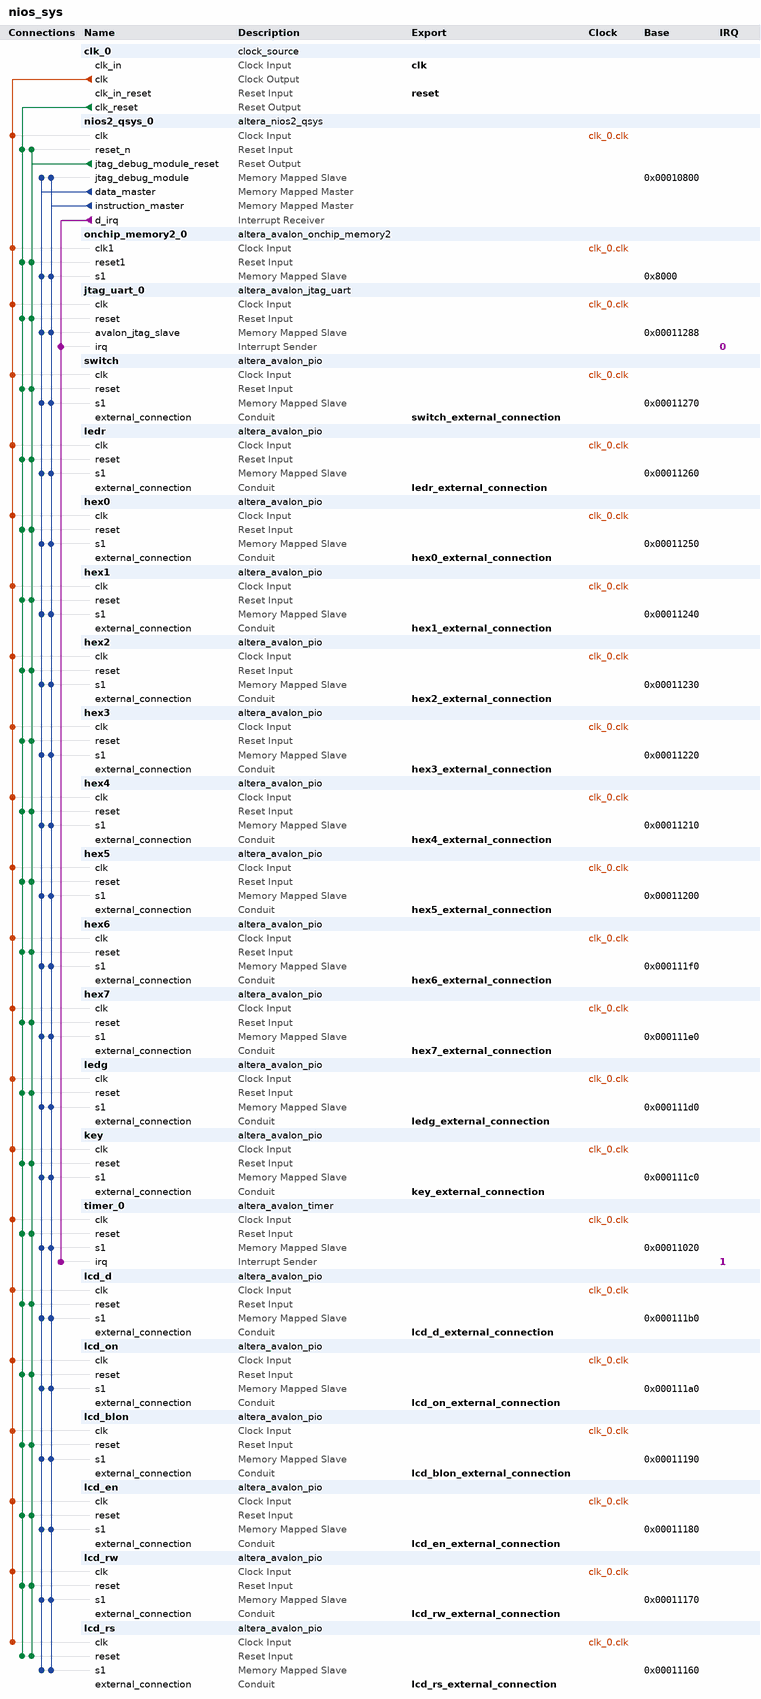
[diagram p0: system contents]
# Platform Designer (Qsys) system nios_sys, Cyclone II EP2C35F672C6
# Parameters at their usual value, and those the tool derives, are not listed.
package require -exact qsys 13.0.1.99.2
create_system nios_sys
set_project_property DEVICE_FAMILY {Cyclone II}
set_project_property DEVICE EP2C35F672C6

add_instance clk_0 clock_source 13.0
set_instance_parameter_value clk_0 clockFrequency 50000000

add_instance nios2_qsys_0 altera_nios2_qsys 13.0
set_instance_parameter_value nios2_qsys_0 resetSlave onchip_memory2_0.s1
set_instance_parameter_value nios2_qsys_0 mmu_TLBMissExcSlave None
set_instance_parameter_value nios2_qsys_0 exceptionSlave onchip_memory2_0.s1
set_instance_parameter_value nios2_qsys_0 breakSlave nios2_qsys_0.jtag_debug_module
set_instance_parameter_value nios2_qsys_0 impl Tiny
set_instance_parameter_value nios2_qsys_0 icache_size 4096

add_instance onchip_memory2_0 altera_avalon_onchip_memory2 13.0.1.99.2
set_instance_parameter_value onchip_memory2_0 dataWidth 32
set_instance_parameter_value onchip_memory2_0 dualPort false
set_instance_parameter_value onchip_memory2_0 initMemContent true
set_instance_parameter_value onchip_memory2_0 initializationFileName onchip_mem.hex
set_instance_parameter_value onchip_memory2_0 memorySize 32768

add_instance jtag_uart_0 altera_avalon_jtag_uart 13.0.1.99.2
set_instance_parameter_value jtag_uart_0 simInteractiveOptions NO_INTERACTIVE_WINDOWS

add_instance switch altera_avalon_pio 13.0.1.99.2
set_instance_parameter_value switch direction Input
set_instance_parameter_value switch width 18

add_instance ledr altera_avalon_pio 13.0.1.99.2
set_instance_parameter_value ledr direction Output
set_instance_parameter_value ledr width 18

add_instance hex0 altera_avalon_pio 13.0.1.99.2
set_instance_parameter_value hex0 direction Output
set_instance_parameter_value hex0 width 7

add_instance hex1 altera_avalon_pio 13.0.1.99.2
set_instance_parameter_value hex1 direction Output
set_instance_parameter_value hex1 width 7

add_instance hex2 altera_avalon_pio 13.0.1.99.2
set_instance_parameter_value hex2 direction Output
set_instance_parameter_value hex2 width 7

add_instance hex3 altera_avalon_pio 13.0.1.99.2
set_instance_parameter_value hex3 direction Output
set_instance_parameter_value hex3 width 7

add_instance hex4 altera_avalon_pio 13.0.1.99.2
set_instance_parameter_value hex4 direction Output
set_instance_parameter_value hex4 width 7

add_instance hex5 altera_avalon_pio 13.0.1.99.2
set_instance_parameter_value hex5 direction Output
set_instance_parameter_value hex5 width 7

add_instance hex6 altera_avalon_pio 13.0.1.99.2
set_instance_parameter_value hex6 direction Output
set_instance_parameter_value hex6 width 7

add_instance hex7 altera_avalon_pio 13.0.1.99.2
set_instance_parameter_value hex7 direction Output
set_instance_parameter_value hex7 width 7

add_instance ledg altera_avalon_pio 13.0.1.99.2
set_instance_parameter_value ledg direction Output
set_instance_parameter_value ledg width 4

add_instance key altera_avalon_pio 13.0.1.99.2
set_instance_parameter_value key direction Input
set_instance_parameter_value key width 4

add_instance timer_0 altera_avalon_timer 13.0.1.99.2
set_instance_parameter_value timer_0 period 1
set_instance_parameter_value timer_0 periodUnits MSEC

add_instance lcd_d altera_avalon_pio 13.0.1.99.2
set_instance_parameter_value lcd_d direction Output
set_instance_parameter_value lcd_d width 8

add_instance lcd_on altera_avalon_pio 13.0.1.99.2
set_instance_parameter_value lcd_on direction Output
set_instance_parameter_value lcd_on width 1

add_instance lcd_blon altera_avalon_pio 13.0.1.99.2
set_instance_parameter_value lcd_blon direction Output
set_instance_parameter_value lcd_blon width 1

add_instance lcd_en altera_avalon_pio 13.0.1.99.2
set_instance_parameter_value lcd_en direction Output
set_instance_parameter_value lcd_en width 1

add_instance lcd_rw altera_avalon_pio 13.0.1.99.2
set_instance_parameter_value lcd_rw direction Output
set_instance_parameter_value lcd_rw width 1

add_instance lcd_rs altera_avalon_pio 13.0.1.99.2
set_instance_parameter_value lcd_rs direction Output
set_instance_parameter_value lcd_rs width 1

# connections
add_connection clk_0.clk hex0.clk clock
add_connection clk_0.clk hex1.clk clock
add_connection clk_0.clk hex2.clk clock
add_connection clk_0.clk hex3.clk clock
add_connection clk_0.clk hex4.clk clock
add_connection clk_0.clk hex5.clk clock
add_connection clk_0.clk hex6.clk clock
add_connection clk_0.clk hex7.clk clock
add_connection clk_0.clk jtag_uart_0.clk clock
add_connection clk_0.clk key.clk clock
add_connection clk_0.clk lcd_blon.clk clock
add_connection clk_0.clk lcd_d.clk clock
add_connection clk_0.clk lcd_en.clk clock
add_connection clk_0.clk lcd_on.clk clock
add_connection clk_0.clk lcd_rs.clk clock
add_connection clk_0.clk lcd_rw.clk clock
add_connection clk_0.clk ledg.clk clock
add_connection clk_0.clk ledr.clk clock
add_connection clk_0.clk nios2_qsys_0.clk clock
add_connection clk_0.clk onchip_memory2_0.clk1 clock
add_connection clk_0.clk switch.clk clock
add_connection clk_0.clk timer_0.clk clock
add_connection clk_0.clk_reset hex0.reset reset
add_connection clk_0.clk_reset hex1.reset reset
add_connection clk_0.clk_reset hex2.reset reset
add_connection clk_0.clk_reset hex3.reset reset
add_connection clk_0.clk_reset hex4.reset reset
add_connection clk_0.clk_reset hex5.reset reset
add_connection clk_0.clk_reset hex6.reset reset
add_connection clk_0.clk_reset hex7.reset reset
add_connection clk_0.clk_reset jtag_uart_0.reset reset
add_connection clk_0.clk_reset key.reset reset
add_connection clk_0.clk_reset lcd_blon.reset reset
add_connection clk_0.clk_reset lcd_d.reset reset
add_connection clk_0.clk_reset lcd_en.reset reset
add_connection clk_0.clk_reset lcd_on.reset reset
add_connection clk_0.clk_reset lcd_rs.reset reset
add_connection clk_0.clk_reset lcd_rw.reset reset
add_connection clk_0.clk_reset ledg.reset reset
add_connection clk_0.clk_reset ledr.reset reset
add_connection clk_0.clk_reset nios2_qsys_0.reset_n reset
add_connection clk_0.clk_reset onchip_memory2_0.reset1 reset
add_connection clk_0.clk_reset switch.reset reset
add_connection clk_0.clk_reset timer_0.reset reset
add_connection nios2_qsys_0.jtag_debug_module_reset hex0.reset reset
add_connection nios2_qsys_0.jtag_debug_module_reset hex1.reset reset
add_connection nios2_qsys_0.jtag_debug_module_reset hex2.reset reset
add_connection nios2_qsys_0.jtag_debug_module_reset hex3.reset reset
add_connection nios2_qsys_0.jtag_debug_module_reset hex4.reset reset
add_connection nios2_qsys_0.jtag_debug_module_reset hex5.reset reset
add_connection nios2_qsys_0.jtag_debug_module_reset hex6.reset reset
add_connection nios2_qsys_0.jtag_debug_module_reset hex7.reset reset
add_connection nios2_qsys_0.jtag_debug_module_reset jtag_uart_0.reset reset
add_connection nios2_qsys_0.jtag_debug_module_reset key.reset reset
add_connection nios2_qsys_0.jtag_debug_module_reset lcd_blon.reset reset
add_connection nios2_qsys_0.jtag_debug_module_reset lcd_d.reset reset
add_connection nios2_qsys_0.jtag_debug_module_reset lcd_en.reset reset
add_connection nios2_qsys_0.jtag_debug_module_reset lcd_on.reset reset
add_connection nios2_qsys_0.jtag_debug_module_reset lcd_rs.reset reset
add_connection nios2_qsys_0.jtag_debug_module_reset lcd_rw.reset reset
add_connection nios2_qsys_0.jtag_debug_module_reset ledg.reset reset
add_connection nios2_qsys_0.jtag_debug_module_reset ledr.reset reset
add_connection nios2_qsys_0.jtag_debug_module_reset nios2_qsys_0.reset_n reset
add_connection nios2_qsys_0.jtag_debug_module_reset onchip_memory2_0.reset1 reset
add_connection nios2_qsys_0.jtag_debug_module_reset switch.reset reset
add_connection nios2_qsys_0.jtag_debug_module_reset timer_0.reset reset
add_connection nios2_qsys_0.data_master hex0.s1 avalon
set_connection_parameter_value nios2_qsys_0.data_master/hex0.s1 baseAddress 0x00011250
add_connection nios2_qsys_0.data_master hex1.s1 avalon
set_connection_parameter_value nios2_qsys_0.data_master/hex1.s1 baseAddress 0x00011240
add_connection nios2_qsys_0.data_master hex2.s1 avalon
set_connection_parameter_value nios2_qsys_0.data_master/hex2.s1 baseAddress 0x00011230
add_connection nios2_qsys_0.data_master hex3.s1 avalon
set_connection_parameter_value nios2_qsys_0.data_master/hex3.s1 baseAddress 0x00011220
add_connection nios2_qsys_0.data_master hex4.s1 avalon
set_connection_parameter_value nios2_qsys_0.data_master/hex4.s1 baseAddress 0x00011210
add_connection nios2_qsys_0.data_master hex5.s1 avalon
set_connection_parameter_value nios2_qsys_0.data_master/hex5.s1 baseAddress 0x00011200
add_connection nios2_qsys_0.data_master hex6.s1 avalon
set_connection_parameter_value nios2_qsys_0.data_master/hex6.s1 baseAddress 0x000111f0
add_connection nios2_qsys_0.data_master hex7.s1 avalon
set_connection_parameter_value nios2_qsys_0.data_master/hex7.s1 baseAddress 0x000111e0
add_connection nios2_qsys_0.data_master jtag_uart_0.avalon_jtag_slave avalon
set_connection_parameter_value nios2_qsys_0.data_master/jtag_uart_0.avalon_jtag_slave baseAddress 0x00011288
add_connection nios2_qsys_0.data_master key.s1 avalon
set_connection_parameter_value nios2_qsys_0.data_master/key.s1 baseAddress 0x000111c0
add_connection nios2_qsys_0.data_master lcd_blon.s1 avalon
set_connection_parameter_value nios2_qsys_0.data_master/lcd_blon.s1 baseAddress 0x00011190
add_connection nios2_qsys_0.data_master lcd_d.s1 avalon
set_connection_parameter_value nios2_qsys_0.data_master/lcd_d.s1 baseAddress 0x000111b0
add_connection nios2_qsys_0.data_master lcd_en.s1 avalon
set_connection_parameter_value nios2_qsys_0.data_master/lcd_en.s1 baseAddress 0x00011180
add_connection nios2_qsys_0.data_master lcd_on.s1 avalon
set_connection_parameter_value nios2_qsys_0.data_master/lcd_on.s1 baseAddress 0x000111a0
add_connection nios2_qsys_0.data_master lcd_rs.s1 avalon
set_connection_parameter_value nios2_qsys_0.data_master/lcd_rs.s1 baseAddress 0x00011160
add_connection nios2_qsys_0.data_master lcd_rw.s1 avalon
set_connection_parameter_value nios2_qsys_0.data_master/lcd_rw.s1 baseAddress 0x00011170
add_connection nios2_qsys_0.data_master ledg.s1 avalon
set_connection_parameter_value nios2_qsys_0.data_master/ledg.s1 baseAddress 0x000111d0
add_connection nios2_qsys_0.data_master ledr.s1 avalon
set_connection_parameter_value nios2_qsys_0.data_master/ledr.s1 baseAddress 0x00011260
add_connection nios2_qsys_0.data_master nios2_qsys_0.jtag_debug_module avalon
set_connection_parameter_value nios2_qsys_0.data_master/nios2_qsys_0.jtag_debug_module baseAddress 0x00010800
add_connection nios2_qsys_0.data_master onchip_memory2_0.s1 avalon
set_connection_parameter_value nios2_qsys_0.data_master/onchip_memory2_0.s1 baseAddress 0x8000
add_connection nios2_qsys_0.data_master switch.s1 avalon
set_connection_parameter_value nios2_qsys_0.data_master/switch.s1 baseAddress 0x00011270
add_connection nios2_qsys_0.data_master timer_0.s1 avalon
set_connection_parameter_value nios2_qsys_0.data_master/timer_0.s1 baseAddress 0x00011020
add_connection nios2_qsys_0.instruction_master hex0.s1 avalon
set_connection_parameter_value nios2_qsys_0.instruction_master/hex0.s1 baseAddress 0x00011250
add_connection nios2_qsys_0.instruction_master hex1.s1 avalon
set_connection_parameter_value nios2_qsys_0.instruction_master/hex1.s1 baseAddress 0x00011240
add_connection nios2_qsys_0.instruction_master hex2.s1 avalon
set_connection_parameter_value nios2_qsys_0.instruction_master/hex2.s1 baseAddress 0x00011230
add_connection nios2_qsys_0.instruction_master hex3.s1 avalon
set_connection_parameter_value nios2_qsys_0.instruction_master/hex3.s1 baseAddress 0x00011220
add_connection nios2_qsys_0.instruction_master hex4.s1 avalon
set_connection_parameter_value nios2_qsys_0.instruction_master/hex4.s1 baseAddress 0x00011210
add_connection nios2_qsys_0.instruction_master hex5.s1 avalon
set_connection_parameter_value nios2_qsys_0.instruction_master/hex5.s1 baseAddress 0x00011200
add_connection nios2_qsys_0.instruction_master hex6.s1 avalon
set_connection_parameter_value nios2_qsys_0.instruction_master/hex6.s1 baseAddress 0x000111f0
add_connection nios2_qsys_0.instruction_master hex7.s1 avalon
set_connection_parameter_value nios2_qsys_0.instruction_master/hex7.s1 baseAddress 0x000111e0
add_connection nios2_qsys_0.instruction_master jtag_uart_0.avalon_jtag_slave avalon
set_connection_parameter_value nios2_qsys_0.instruction_master/jtag_uart_0.avalon_jtag_slave baseAddress 0x00011288
add_connection nios2_qsys_0.instruction_master key.s1 avalon
set_connection_parameter_value nios2_qsys_0.instruction_master/key.s1 baseAddress 0x000111c0
add_connection nios2_qsys_0.instruction_master lcd_blon.s1 avalon
set_connection_parameter_value nios2_qsys_0.instruction_master/lcd_blon.s1 baseAddress 0x00011190
add_connection nios2_qsys_0.instruction_master lcd_d.s1 avalon
set_connection_parameter_value nios2_qsys_0.instruction_master/lcd_d.s1 baseAddress 0x000111b0
add_connection nios2_qsys_0.instruction_master lcd_en.s1 avalon
set_connection_parameter_value nios2_qsys_0.instruction_master/lcd_en.s1 baseAddress 0x00011180
add_connection nios2_qsys_0.instruction_master lcd_on.s1 avalon
set_connection_parameter_value nios2_qsys_0.instruction_master/lcd_on.s1 baseAddress 0x000111a0
add_connection nios2_qsys_0.instruction_master lcd_rs.s1 avalon
set_connection_parameter_value nios2_qsys_0.instruction_master/lcd_rs.s1 baseAddress 0x00011160
add_connection nios2_qsys_0.instruction_master lcd_rw.s1 avalon
set_connection_parameter_value nios2_qsys_0.instruction_master/lcd_rw.s1 baseAddress 0x00011170
add_connection nios2_qsys_0.instruction_master ledg.s1 avalon
set_connection_parameter_value nios2_qsys_0.instruction_master/ledg.s1 baseAddress 0x000111d0
add_connection nios2_qsys_0.instruction_master ledr.s1 avalon
set_connection_parameter_value nios2_qsys_0.instruction_master/ledr.s1 baseAddress 0x00011260
add_connection nios2_qsys_0.instruction_master nios2_qsys_0.jtag_debug_module avalon
set_connection_parameter_value nios2_qsys_0.instruction_master/nios2_qsys_0.jtag_debug_module baseAddress 0x00010800
add_connection nios2_qsys_0.instruction_master onchip_memory2_0.s1 avalon
set_connection_parameter_value nios2_qsys_0.instruction_master/onchip_memory2_0.s1 baseAddress 0x8000
add_connection nios2_qsys_0.instruction_master switch.s1 avalon
set_connection_parameter_value nios2_qsys_0.instruction_master/switch.s1 baseAddress 0x00011270
add_connection nios2_qsys_0.instruction_master timer_0.s1 avalon
set_connection_parameter_value nios2_qsys_0.instruction_master/timer_0.s1 baseAddress 0x00011020
add_connection nios2_qsys_0.d_irq jtag_uart_0.irq interrupt
set_connection_parameter_value nios2_qsys_0.d_irq/jtag_uart_0.irq irqNumber 0
add_connection nios2_qsys_0.d_irq timer_0.irq interrupt
set_connection_parameter_value nios2_qsys_0.d_irq/timer_0.irq irqNumber 1

# exported interfaces
add_interface clk clock sink
set_interface_property clk EXPORT_OF clk_0.clk_in
add_interface reset reset sink
set_interface_property reset EXPORT_OF clk_0.clk_in_reset
add_interface hex7_external_connection conduit end
set_interface_property hex7_external_connection EXPORT_OF hex7.external_connection
add_interface hex6_external_connection conduit end
set_interface_property hex6_external_connection EXPORT_OF hex6.external_connection
add_interface hex5_external_connection conduit end
set_interface_property hex5_external_connection EXPORT_OF hex5.external_connection
add_interface hex4_external_connection conduit end
set_interface_property hex4_external_connection EXPORT_OF hex4.external_connection
add_interface hex3_external_connection conduit end
set_interface_property hex3_external_connection EXPORT_OF hex3.external_connection
add_interface hex2_external_connection conduit end
set_interface_property hex2_external_connection EXPORT_OF hex2.external_connection
add_interface hex1_external_connection conduit end
set_interface_property hex1_external_connection EXPORT_OF hex1.external_connection
add_interface hex0_external_connection conduit end
set_interface_property hex0_external_connection EXPORT_OF hex0.external_connection
add_interface ledr_external_connection conduit end
set_interface_property ledr_external_connection EXPORT_OF ledr.external_connection
add_interface switch_external_connection conduit end
set_interface_property switch_external_connection EXPORT_OF switch.external_connection
add_interface ledg_external_connection conduit end
set_interface_property ledg_external_connection EXPORT_OF ledg.external_connection
add_interface key_external_connection conduit end
set_interface_property key_external_connection EXPORT_OF key.external_connection
add_interface lcd_rs_external_connection conduit end
set_interface_property lcd_rs_external_connection EXPORT_OF lcd_rs.external_connection
add_interface lcd_rw_external_connection conduit end
set_interface_property lcd_rw_external_connection EXPORT_OF lcd_rw.external_connection
add_interface lcd_en_external_connection conduit end
set_interface_property lcd_en_external_connection EXPORT_OF lcd_en.external_connection
add_interface lcd_blon_external_connection conduit end
set_interface_property lcd_blon_external_connection EXPORT_OF lcd_blon.external_connection
add_interface lcd_on_external_connection conduit end
set_interface_property lcd_on_external_connection EXPORT_OF lcd_on.external_connection
add_interface lcd_d_external_connection conduit end
set_interface_property lcd_d_external_connection EXPORT_OF lcd_d.external_connection

set_interconnect_requirement {$system} qsys_mm.clockCrossingAdapter HANDSHAKE
set_interconnect_requirement {$system} qsys_mm.maxAdditionalLatency 1

save_system nios_sys.qsys
